# EAGLE design BusPirate-v3.5b-SSOP (EAGLE 5.07)
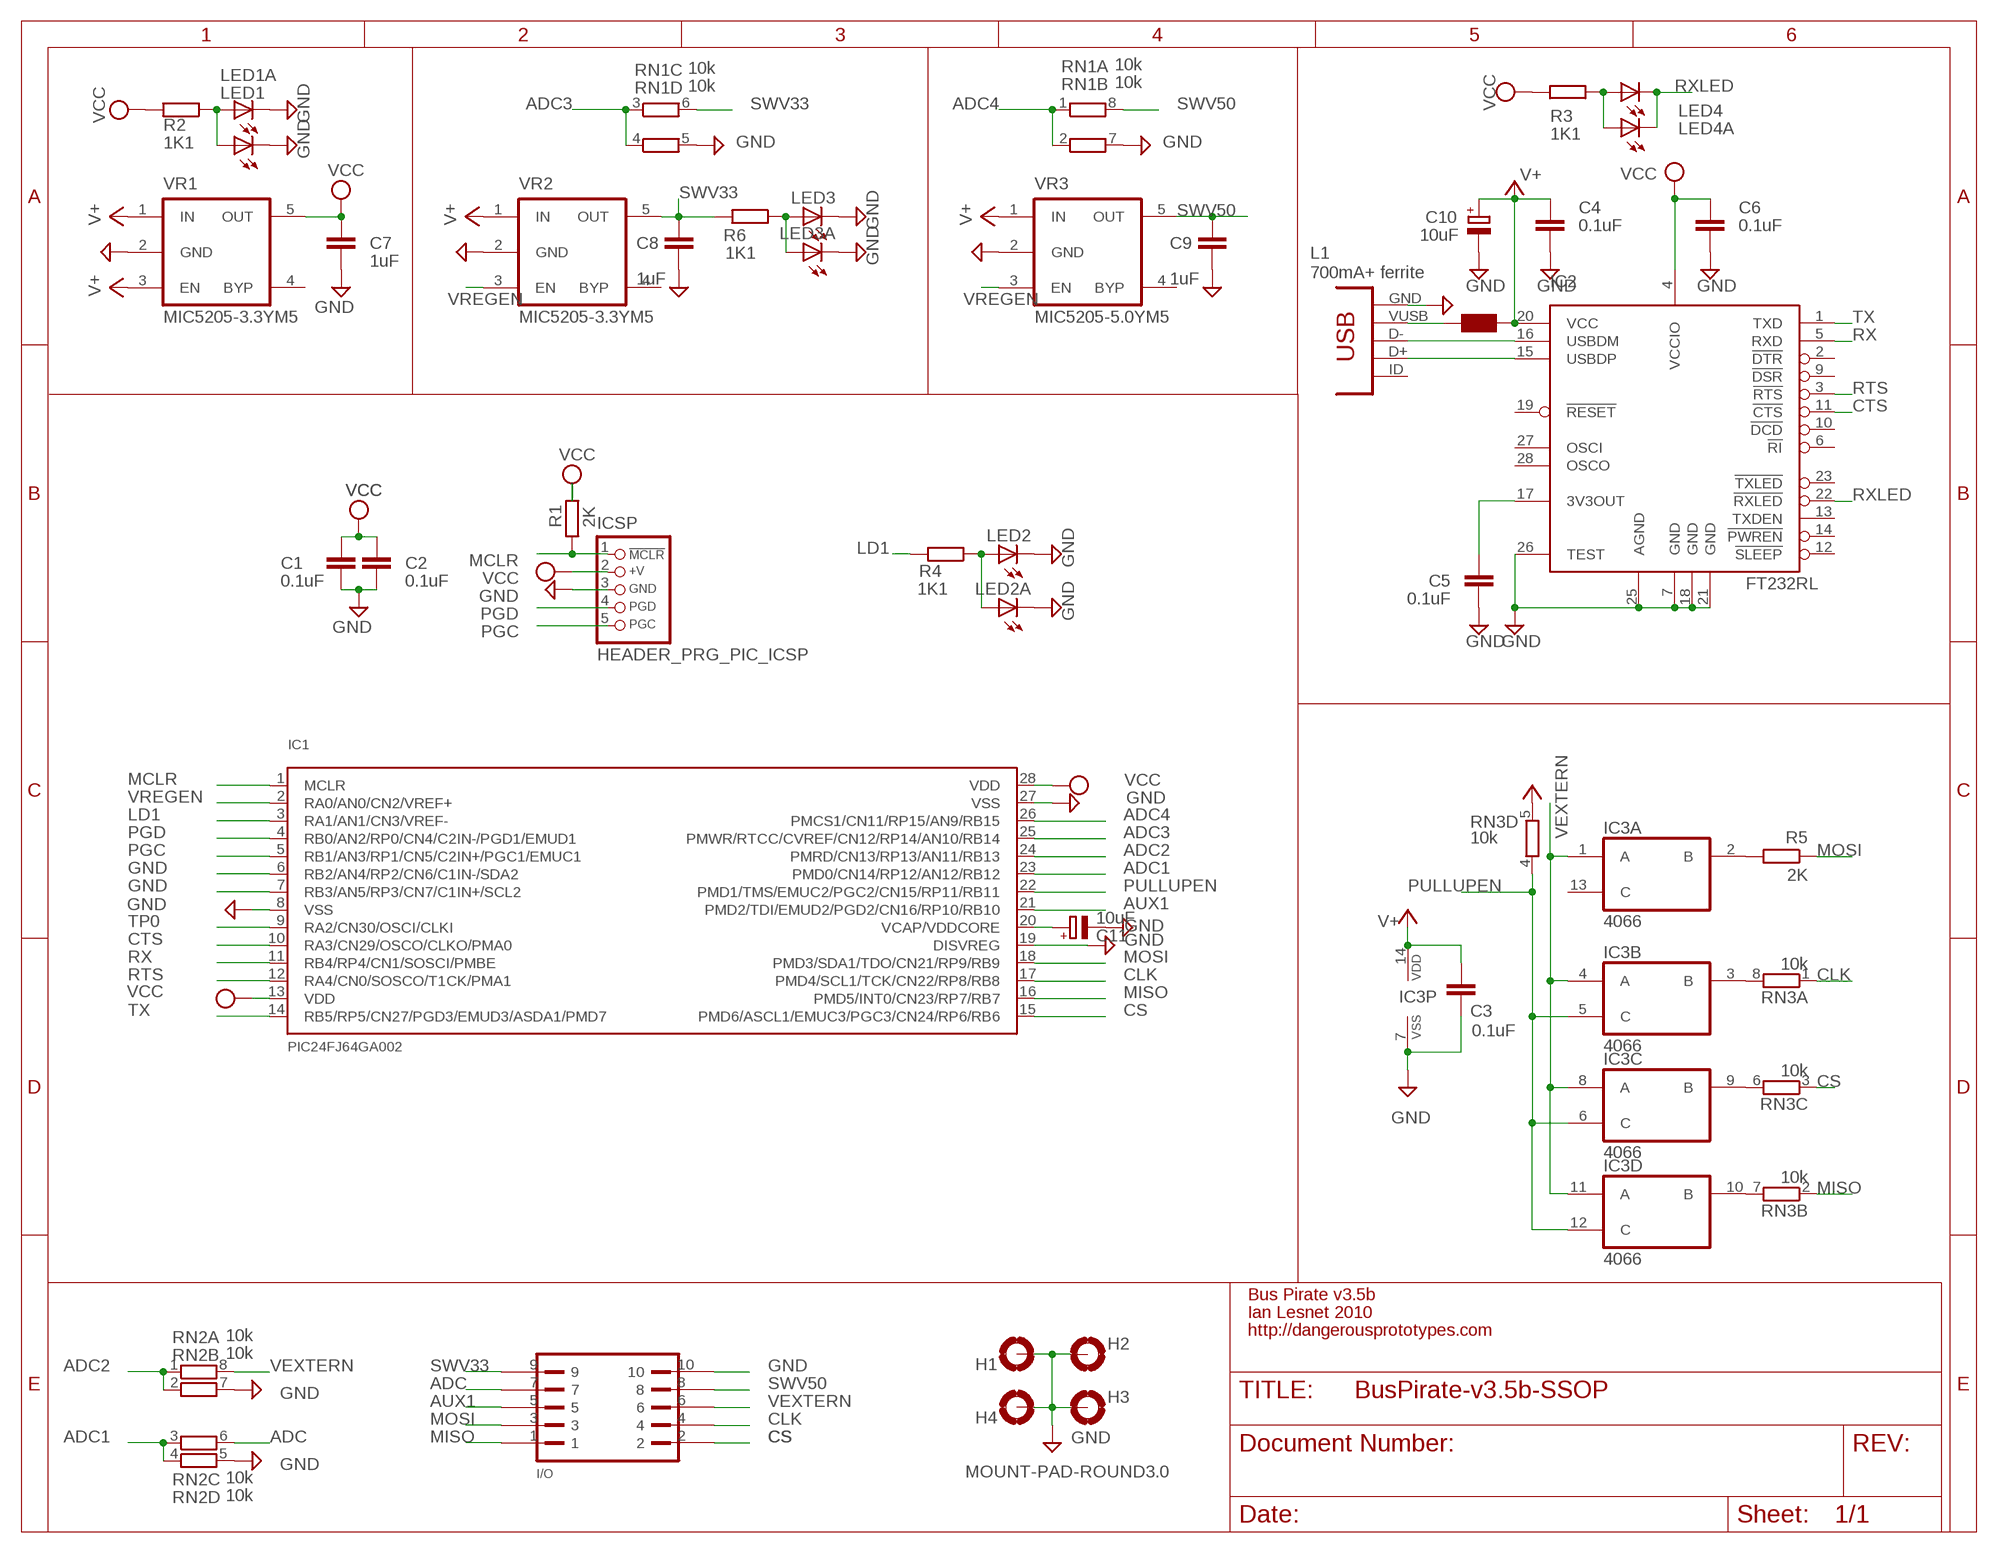
[diagram p0: schematic, sheet 1]

## Parts
C1  0.1uF  CAPC603  [C603]
C2  0.1uF  CAPC603  [C603]
C3  0.1uF  CAPC603  [C603]
C4  0.1uF  CAPC603  [C603]
C5  0.1uF  CAPC603  [C603]
C6  0.1uF  CAPC603  [C603]
C7  1uF  CAPC603  [C603]
C8  1uF  CAPC603  [C603]
C9  1uF  CAPC603  [C603]
C10  10uF  CPOL-EUSMCA  [SMC_A]
C11  10uF  CPOL-EUSMCA  [SMC_A]
H1  MOUNT-PAD-ROUND3.0  [3,0-PAD]
H2  MOUNT-PAD-ROUND3.0  [3,0-PAD]
H3  MOUNT-PAD-ROUND3.0  [3,0-PAD]
H4  MOUNT-PAD-ROUND3.0  [3,0-PAD]
I/O  HEADER2X5-SHRD-PTH-B  [PINSHRD_PTH_2X05B]
IC1  PIC24FJ64GA002  [SSOP28]
IC2  FT232RL  [SSOP28]
IC3  4066  [TSSOP14]
ICSP  HEADER_PRG_PIC_ICSP  HEADER_PRG_PIC_ICSPB  [HEADER_PRG_1X05_ICSP_B]
J1  CONN_USB  [CONN_USB_MINI-B]
L1  700mA+ ferrite  WE-KIL_0805  [WE-KI_0805_B]
LED1  LEDCHIP-LED0805  [CHIP-LED0805]
LED1A  LEDCHIP-LED0805  [CHIP-LED0805]
LED2  LEDCHIP-LED0805  [CHIP-LED0805]
LED2A  LEDCHIP-LED0805  [CHIP-LED0805]
LED3  LEDCHIP-LED0805  [CHIP-LED0805]
LED3A  LEDCHIP-LED0805  [CHIP-LED0805]
LED4  LEDCHIP-LED0805  [CHIP-LED0805]
LED4A  LEDCHIP-LED0805  [CHIP-LED0805]
R1  2K  RESISTORR603  [R603]
R2  1K1  RESISTORR603  [R603]
R3  1K1  RESISTORR603  [R603]
R4  1K1  RESISTORR603  [R603]
R5  2K  RESISTORR603  [R603]
R6  1K1  RESISTORR603  [R603]
RN1  10k  RNETWORK  [RN8P-4R-CRA06S]
RN2  10k  RNETWORK  [RN8P-4R-CRA06S]
RN3  10k  RNETWORK  [RN8P-4R-CRA06S]
VR1  MIC5205-3.3YM5  MIC5205  [SOT-23-5]
VR2  MIC5205-3.3YM5  MIC5205  [SOT-23-5]
VR3  MIC5205-5.0YM5  MIC5205  [SOT-23-5]

## Nets
$N26: J1.VUSB L1.2
ADC: I/O.7 RN2.6
ADC1: IC1.23(PMD0/CN14/RP12/AN12/RB12) RN2.3 RN2.4
ADC2: IC1.24(PMRD/CN13/RP13/AN11/RB13) RN2.1 RN2.2
ADC3: IC1.25(PMWR/RTCC/CVREF/CN12/RP14/AN10/RB14) RN1.3 RN1.4
ADC4: IC1.26(PMCS1/CN11/RP15/AN9/RB15) RN1.1 RN1.2
AUX1: I/O.5 IC1.21(PMD2/TDI/EMUD2/PGD2/CN16/RP10/RB10)
CLK: I/O.4 IC1.17(PMD4/SCL1/TCK/CN22/RP8/RB8) RN3.1
CS: I/O.2 IC1.15(PMD6/ASCL1/EMUC3/PGC3/CN24/RP6/RB6) RN3.3
CTS: IC1.10(RA3/CN29/OSCO/CLKO/PMA0) IC2.11(!CTS)
GND: C1.2 C2.2 C3.2 C4.2 C5.2 C6.2 C7.2 C8.2 C9.2 C10.- C11.- H1.B3,0(MOUNT) H2.B3,0(MOUNT) H3.B3,0(MOUNT) H4.B3,0(MOUNT) I/O.10 IC1.6(RB2/AN4/RP2/CN6/C1IN-/SDA2) IC1.7(RB3/AN5/RP3/CN7/C1IN+/SCL2) IC1.8(VSS) IC1.19(DISVREG) IC1.27(VSS) IC2.7(GND) IC2.18(GND) IC2.21(GND) IC2.25(AGND) IC2.26(TEST) IC3.7(P:VSS) ICSP.3(GND) J1.GND LED1.C LED1A.C LED2.C LED2A.C LED3.C LED3A.C RN1.5 RN1.7 RN2.5 RN2.7 VR1.2(GND) VR2.2(GND) VR3.2(GND)
LD1: IC1.3(RA1/AN1/CN3/VREF-) R4.2
MCLR: IC1.1(MCLR) ICSP.1(/MCLR) R1.1
MISO: I/O.1 IC1.16(PMD5/INT0/CN23/RP7/RB7) RN3.2
MOSI: I/O.3 IC1.18(PMD3/SDA1/TDO/CN21/RP9/RB9) R5.1
N$1: IC3.2(A:B) R5.2
N$2: IC3.9(C:B) RN3.6
N$3: C11.+ IC1.20(VCAP/VDDCORE)
N$4: IC3.10(D:B) RN3.7
N$5: IC3.3(B:B) RN3.8
N$6: LED2.A LED2A.A R4.1
N$7: LED1.A LED1A.A R2.1
N$9: C5.1 IC2.17(3V3OUT)
N$13: LED4.A LED4A.A R3.1
N$15: IC2.15(USBDP) J1.D+
N$16: IC2.16(USBDM) J1.D-
N$18: LED3.A LED3A.A R6.1
PGC: IC1.5(RB1/AN3/RP1/CN5/C2IN+/PGC1/EMUC1) ICSP.5(PGC)
PGD: IC1.4(RB0/AN2/RP0/CN4/C2IN-/PGD1/EMUD1) ICSP.4(PGD)
PULLUPEN: IC1.22(PMD1/TMS/EMUC2/PGC2/CN15/RP11/RB11) IC3.5(B:C) IC3.6(C:C) IC3.12(D:C) RN3.4
RTS: IC1.12(RA4/CN0/SOSCO/T1CK/PMA1) IC2.3(!RTS)
RX: IC1.11(RB4/RP4/CN1/SOSCI/PMBE) IC2.5(RXD)
RXLED: IC2.22(!RXLED) LED4.C LED4A.C
SWV33: C8.1 I/O.9 R6.2 RN1.6 VR2.5(OUT)
SWV50: C9.1 I/O.8 RN1.8 VR3.5(OUT)
TP0: IC1.9(RA2/CN30/OSCI/CLKI)
TX: IC1.14(RB5/RP5/CN27/PGD3/EMUD3/ASDA1/PMD7) IC2.1(TXD)
V+: C3.1 C4.1 C10.+ IC2.20(VCC) IC3.14(P:VDD) L1.1 RN3.5 VR1.1(IN) VR1.3(EN) VR2.1(IN) VR3.1(IN)
VCC: C1.1 C2.1 C6.1 C7.1 IC1.13(VDD) IC1.28(VDD) IC2.4(VCCIO) ICSP.2(+V) R1.2 R2.2 R3.2 VR1.5(OUT)
VEXTERN: I/O.6 IC3.1(A:A) IC3.4(B:A) IC3.8(C:A) IC3.11(D:A) RN2.8
VREGEN: IC1.2(RA0/AN0/CN2/VREF+) VR2.3(EN) VR3.3(EN)
Unconnected: IC2.2(!DTR) IC2.6(!RI) IC2.9(!DSR) IC2.10(!DCD) IC2.12(!SLEEP) IC2.13(TXDEN) IC2.14(!PWREN) IC2.19(!RESET) IC2.23(!TXLED) IC2.27(OSCI) IC2.28(OSCO) IC3.13(A:C) J1.BODY@1(BODY) J1.BODY@2(BODY) J1.BODY@3(BODY) J1.BODY@4(BODY) J1.ID(USBID) VR1.4(BYP) VR2.4(BYP) VR3.4(BYP)

## Notes on the sheet
- Bus Pirate v3.5b
- Ian Lesnet 2010
- http://dangerousprototypes.com

## Library data of the parts
C1-C9 = dp_devices:CAP
C10 C11 = rcl:CPOL-EU: POLARIZED CAPACITOR, European symbol
H1-H4 = holes:MOUNT-PAD-ROUND: MOUNTING PAD, round
I/O = dp_devices:HEADER2X5-SHRD-PTH: Shrouded pin header, 2.54mm pitch
IC1 = dp_devices:PIC24FJ64GA002: 16-bit General Purpose Flash Microcontroller
IC2 = dp_devices:FT232RL: USB to serial UART interface
IC3 = 40xx:4066: Quad bilateral ANALOG SWITCH
ICSP = dp_devices:HEADER_PRG_PIC_ICSP: 5-pin PIC In Circuit Serial Programming header
J1 = dp_devices:CONN_USB: USB connector
L1 = wuerth-elektronik:WE-KIL: SMD Wire Wound Ceramic Inductor WE-KIL - Low profile - High Q values -- Bluetooth -- Wireless LAN -- RF oscillation circuit -- IF impedance matching
LED1 LED1A LED2 LED2A LED3 LED3A LED4 LED4A = led:LED: LED OSRAM: - CHIPLED LG R971, LG N971, LY N971, LG Q971, LY Q971, LO R971, LY R971 LH N974, LH R974 LS Q976, LO Q976, LY Q976 LO Q996 - Hyper CHIPLED LW Q18S LB Q993, LB Q99A, LB R99A - SideLED LS A670, LO A670, LY A670, LG A670, LP A670 LB A673, LV A673, LT A673, LW A673 LH A674 LY A675 LS A676, LA A676, LO A676, LY A676, LW A676 LS A679, LY A679, LG A679 - Hyper Micro SIDELED® LS Y876, LA Y876, LO Y876, LY Y876 LT Y87S - SmartLED LW L88C, LW L88S LB L89C, LB L89S, LG L890 LS L89K, LO L89K, LY L89K LS L896, LA L896, LO L896, LY L896 - TOPLED LS T670, LO T670, LY T670, LG T670, LP T670 LSG T670, LSP T670, LSY T670, LOP T670, LYG T670 LG T671, LOG T671, LSG T671 LB T673, LV T673, LT T673, LW T673 LH T674 LS T676, LA T676, LO T676, LY T676, LB T676, LH T676, LSB T676, LW T676 LB T67C, LV T67C, LT T67C, LS T67K, LO T67K, LY T67K, LW E67C LS E67B, LA E67B, LO E67B, LY E67B, LB E67C, LV E67C, LT E67C LW T67C LS T679, LY T679, LG T679 LS T770, LO T770, LY T770, LG T770, LP T770 LB T773, LV T773, LT T773, LW T773 LH T774 LS E675, LA E675, LY E675, LS T675 LS T776, LA T776, LO T776, LY T776, LB T776 LHGB T686 LT T68C, LB T68C - Hyper Mini TOPLED® LB M676 - Mini TOPLED Santana® LG M470 LS M47K, LO M47K, LY M47K Source: http://www.osram.convergy.de LUXEON: - LUMILED® LXK2-PW12-R00, LXK2-PW12-S00, LXK2-PW14-U00, LXK2-PW14-V00 LXK2-PM12-R00, LXK2-PM12-S00, LXK2-PM14-U00 LXK2-PE12-Q00, LXK2-PE12-R00, LXK2-PE12-S00, LXK2-PE14-T00, LXK2-PE14-U00 LXK2-PB12-K00, LXK2-PB12-L00, LXK2-PB12-M00, LXK2-PB14-N00, LXK2-PB14-P00, LXK2-PB14-Q00 LXK2-PR12-L00, LXK2-PR12-M00, LXK2-PR14-Q00, LXK2-PR14-R00 LXK2-PD12-Q00, LXK2-PD12-R00, LXK2-PD12-S00 LXK2-PH12-R00, LXK2-PH12-S00 LXK2-PL12-P00, LXK2-PL12-Q00, LXK2-PL12-R00 Source: www.luxeon.com KINGBRIGHT: KA-3528ASYC Source: www.kingbright.com
R1-R6 = dp_devices:RESISTOR
RN1-RN3 = dp_devices:RNETWORK: 4 Resistor Array 0603
VR1-VR3 = dp_devices:MIC5205: 150ma Low-Noise LDO Regulator

## Board
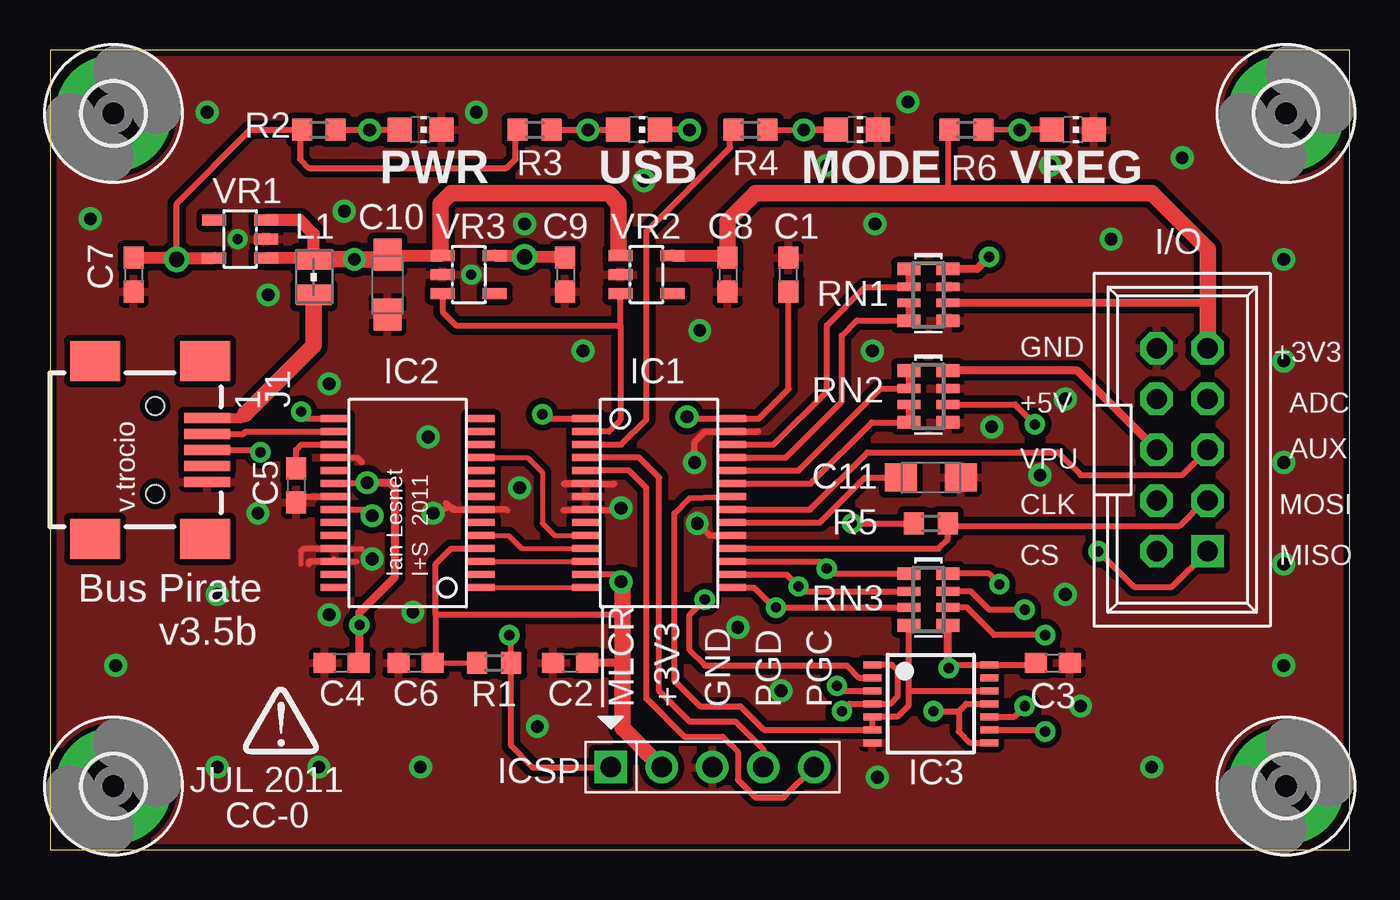
[diagram p1: board, top side]
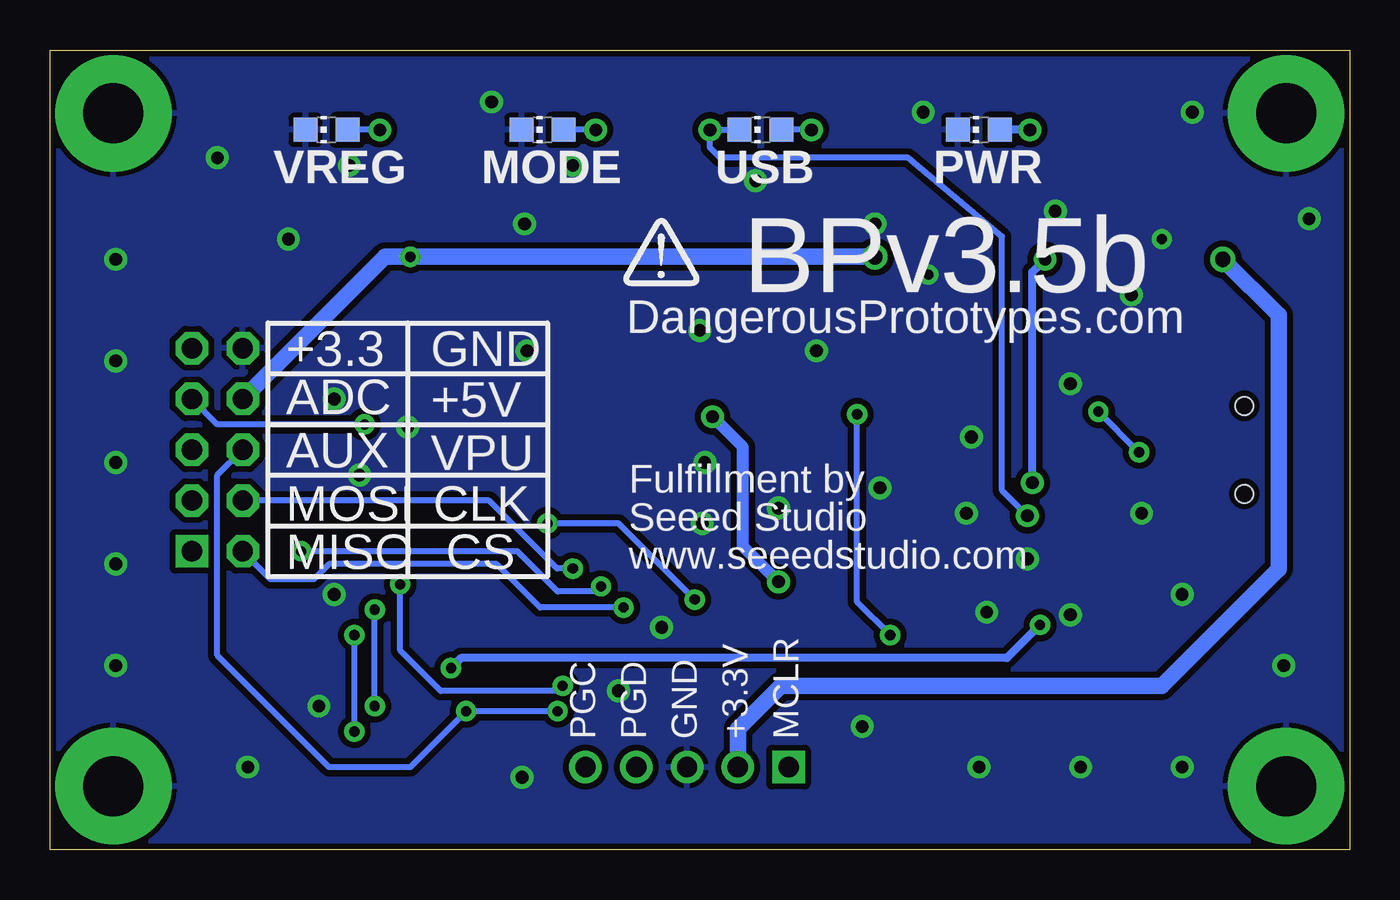
[diagram p2: board, bottom side, seen from below]

Size 65 x 40 mm. Coordinates in mm from the lower left corner, seen from the top.
Outline: 0,40 0,0 65,0 65,40 0,40
Copper layers (1*16): Top 0.035mm / dielectric 1.5mm / Bottom 0.035mm
Design rules "SparkFun": minimum track width 8mil, minimum drill 20mil, track to track 8mil, track to pad 8mil, pad to pad 8mil, via to via 8mil, smd to smd 8mil, copper to edge 10mil, drill to drill 8mil, minimum pad ring 12mil, minimum via ring 10mil, stop-mask expansion 4mil, vias tented up to drill 25mil, thermal gap 10mil

### Footprints (pad centres in the part's own frame; a part is rotated, then mirrored left to right if it is on the bottom)
C603 = smd 1.1 x 1: 1 -0.85,0; 2 0.85,0
SMC_A = smd 1.6 x 1.4: + -1.5,0; - 1.5,0
3,0-PAD = drill 3 pad 5.842 round: B3,0 0,0
PINSHRD_PTH_2X05B = drill 1.016 square: 1 -5.08,-1.27 | drill 1.016 octagon: 2 -5.08,1.27; 3 -2.54,-1.27; 4 -2.54,1.27; 5 0,-1.27; 6 0,1.27; 7 2.54,-1.27; 8 2.54,1.27; 9 5.08,-1.27; 10 5.08,1.27
SSOP28 = smd 0.348 x 1.397: 1 -4.225,-3.656; 2 -3.575,-3.656; 3 -2.925,-3.656; 4 -2.275,-3.656; 5 -1.625,-3.656; 6 -0.975,-3.656; 7 -0.325,-3.656; 8 0.325,-3.656; 9 0.975,-3.656; 10 1.625,-3.656; 11 2.275,-3.656; 12 2.925,-3.656; 13 3.575,-3.656; 14 4.225,-3.656; 15 4.225,3.656; 16 3.575,3.656; 17 2.925,3.656; 18 2.275,3.656; 19 1.625,3.656; 20 0.975,3.656; 21 0.325,3.656; 22 -0.325,3.656; 23 -0.975,3.656; 24 -1.625,3.656; 25 -2.275,3.656; 26 -2.925,3.656; 27 -3.575,3.656; 28 -4.225,3.656
TSSOP14 = smd 0.35 x 0.9: 1 -1.95,-2.925; 2 -1.3,-2.925; 3 -0.65,-2.925; 4 0,-2.925; 5 0.65,-2.925; 6 1.3,-2.925; 7 1.95,-2.925; 8 1.95,2.925; 9 1.3,2.925; 10 0.65,2.925; 11 0,2.925; 12 -0.65,2.925; 13 -1.3,2.925; 14 -1.95,2.925
HEADER_PRG_1X05_ICSP_B = drill 1.016 square: 1 -5.08,0 | drill 1.016 round: 2 -2.54,0; 3 0,0; 4 2.54,0; 5 5.08,0
CONN_USB_MINI-B@1 = smd 2 x 2.5: BODY@1 -4.45,2.5; BODY@2 4.45,2.5; BODY@3 4.45,-3; BODY@4 -4.45,-3 | smd 0.5 x 2.3: D+ 0,2.6; D- -0.8,2.6; GND 1.6,2.6; ID 0.8,2.6; VUSB -1.6,2.6 | hole 0.9: -2.2,0; 2.2,0
WE-KI_0805_B = smd 1.02 x 1.78: 1 -0.89,0; 2 0.89,0
CHIP-LED0805 = smd 1.2 x 1.2: A 0,-1.05; C 0,1.05
R603 = smd 1 x 1.1: 1 -0.85,0; 2 0.85,0
RN8P-4R-CRA06S = smd 0.63 x 1.15: 1 -1.295,-0.975; 4 1.295,-0.975; 5 1.295,0.975; 8 -1.295,0.975 | smd 0.44 x 1.15: 2 -0.4,-0.975; 3 0.4,-0.975; 6 0.4,0.975; 7 -0.4,0.975
SOT-23-5 = smd 0.55 x 1.2: 1 -0.95,-1.3; 2 0,-1.3; 3 0.95,-1.3; 4 0.95,1.3; 5 -0.95,1.3

### Placement (x,y rotation side)
C1  36.95,28.76 90 top
C2  26.02,9.33 180 top
C3  50.15,9.33 0 top
C4  14.59,9.33 180 top
C5  12.31,18.22 270 top
C6  18.28,9.33 180 top
C7  4.18,28.76 270 top
C8  33.9,28.76 270 top
C9  25.77,28.76 270 top
C10  16.88,28.25 270 top
C11  44.06,18.6 0 top
H1  3.17,3.17 0 top
H2  3.17,36.83 0 top
H3  61.83,36.83 0 top
H4  61.83,3.17 0 top
I/O  56.63,20 90 top
IC1  30.47,17.33 270 top
IC2  17.89,17.33 90 top
IC3  44.06,7.3 270 top
ICSP  33.13,4.12 0 top
J1  CONN_USB  [CONN_USB_MINI-B@1]  5.26,20 270 top
L1  13.2,28.64 270 top
LED1  18.53,36 270 top
LED1A  18.53,36 90 bottom
LED2  40.37,36 270 top
LED2A  40.37,36 90 bottom
LED3  51.17,36 270 top
LED3A  51.17,36 90 bottom
LED4  29.45,36 270 top
LED4A  29.45,36 90 bottom
R1  22.21,9.33 180 top
R2  13.45,36 180 top
R3  24.25,36 180 top
R4  35.04,36 180 top
R5  44.06,16.32 180 top
R6  45.84,36 180 top
RN1  43.93,27.75 270 top
RN2  43.93,22.67 270 top
RN3  43.93,12.51 270 top
U$1  [DP-LOGO]  9.64,4.76 0 top
U$2  [DP-LOGO-BOTTOM]  32.51,28.19 0 top
VR1  9.51,30.54 90 top
VR2  29.83,28.76 270 top
VR3  20.94,28.76 270 top

### Tracks (layer width: path | path; a pad name or v marks a point on that pad's centre or on a via)
$N26
  Top 0.508: J1.VUSB 9.59,21.6 9.77,21.78
  Top 0.813: L1.2 13.2,25.21 9.77,21.78
ADC  (via drill 0.51)
  Top 0.305: RN2.6 48.27,22.27 v49.26,21.27
  Bottom 0.305: v49.26,21.27 56.63,21.27 I/O.7
ADC1
  Top 0.305: RN2.3 RN2.4 41.11,21.37 38.05,18.31 IC1.23
ADC2
  Top 0.305: RN2.1 RN2.2 41.54,23.07 37.43,18.96 IC1.24
ADC3
  Top 0.305: RN1.3 RN1.4 40.4,26.45 40.37,26.48 39.61,25.71 39.61,22.41 36.81,19.61 IC1.25
ADC4
  Top 0.305: RN1.1 RN1.2 40.77,28.15 38.85,26.22 38.85,22.92 36.19,20.26 IC1.26
AUX1
  Top 0.305: IC1.21 38.02,17.01 40.88,19.87 50.41,19.87 51.55,18.73 56.63,18.73 I/O.5
CLK  (via drill 0.51)
  Top 0.305: IC1.17 38.5,14.41 v38.85,14.06 39.1,13.8 RN3.1
  Bottom 0.305: v38.85,14.06 39.64,14.06 43.04,17.46 I/O.4
CS  (via drill 0.51)
  Top 0.305: IC1.15 35.2,13.11 36.2,12.11 v36.31,12.11 RN3.3
  Bottom 0.305: v36.31,12.11 40.48,12.11 42.66,14.29 51.04,14.29 51.8,13.52 53.96,13.52 I/O.2
CTS
  Top 0.254: IC2.11 23.88,19.61 24.63,18.86 24.63,16.32 25.23,15.71 IC1.10
GND  (via drill 0.51, 0.64)
  Top 0.254: IC2.18 15.37,19.61 | 12.56,14.29 12.56,14.92 | 14.09,15.05 15.61,15.05 | 14.21,14.41 14.21,14.54 | 14.21,14.41 15.36,14.41 | IC2.26 14.22,14.41 14.21,14.41
  Top 0.305: 20.12,17.01 20.2,17.08 20.05,17.08 | 20.05,17.08 19.8,17.08 | 20.12,17.01 IC2.7 | 20.05,17.08 19.8,17.33 | 20.12,17.01 20.05,17.08 | 15.37,19.61 15.61,19.36 | IC2.21 12.43,17.66 C5.2 | IC2.25 12.7,15.06 12.56,14.92 | IC2.26 12.94,14.41 12.94,14.29 | v32.25,19.36 32.25,20.38 32.77,20.91 IC1.27 | IC1.19 32.98,15.71 v32.37,16.32 | 28.23,18.3 25.69,18.3 25.7,18.31 IC1.6 | 25.67,16.98 28.46,16.98 | IC1.27 35.42,20.91 | IC1.27 34,20.91 | 21.32,17 22.85,17 22.87,16.98
  other vias: 23.74,31.3 21.07,28.76 9.39,30.54 8.37,4.12 13.45,4.12 18.53,4.12 24.37,6.16 3.29,9.21 55.11,4.12 61.71,9.21 61.71,14.29 61.71,19.36 61.71,24.45 61.71,29.52 56.63,34.6 53.07,30.54 41.26,31.3 38.85,34.22 50.03,34.22 29.71,33.46 14.72,31.94 18.91,20.64 19.16,16.82 18.15,11.87 13.96,11.74 8.37,12.76 10.4,16.82 10.91,27.75 13.96,23.3 34.41,11.11 16.12,14.54 50.79,12.76 51.55,7.17 41.39,3.62 49.52,18.73 50.79,22.54 47.1,21.14 23.48,18.09 28.56,17.08 36.56,7.93 41.14,24.95 32.5,25.97 26.66,24.95 2.02,31.56 7.86,36.89 21.32,36.89 42.91,37.4
  pour Top (isolate 0.305): 0,40 65,40 65,0 0,0
  pour Bottom (isolate 0.305): 0,40 65,40 65,0 0,0
LD1
  Top 0.305: 34.28,35.88 R4.2 34.02,35.84 34.02,35.11 29.83,30.92 29.83,21.52 28.57,20.26 IC1.3
  Top 0.406: R4.2 33.9,35.68
MCLR  (via drill 0.51)
  Top 0.305: ICSP.1 24.12,4.12 23.06,5.18 R1.1 23.06,10.64 v22.98,10.73 | IC1.1 24.85,21.56 v24.63,21.78
  Bottom 0.305: v24.63,21.78 24.63,12.38 v22.98,10.73
MISO  (via drill 0.51)
  Top 0.305: I/O.1 56.12,13.14 54.22,13.14 v52.44,14.92 | IC1.16 36.84,13.76 v37.43,13.16 | v37.43,13.16 37.33,13.27 | v37.43,13.16 37.69,12.91 RN3.2
  Bottom 0.305: v52.44,14.92 41.62,14.92 39.61,12.91 37.69,12.91 v37.43,13.16
MOSI
  Top 0.305: I/O.3 57.77,17.46 56.5,16.19 45.03,16.19 R5.1 44.91,15.52 44.45,15.06 IC1.18
N$1  (via drill 0.51)
  Top 0.305: v40.12,16.32 R5.2 | IC3.2 40.47,8.6 39.87,9.21 32.75,9.21 31.99,9.97 31.99,11.74 v32.75,12.51
  Bottom 0.305: v40.12,16.32 36.56,16.32 v32.75,12.51
N$2  (via drill 0.51)
  Top 0.305: IC3.9 49.67,6 v49.77,5.9 | RN3.6 45.85,12.11 47.23,10.73 v49.77,10.73
  Bottom 0.305: v49.77,5.9 v49.77,10.73
N$3
  Top 0.305: IC1.20 38.51,16.36 40.76,18.6 C11.+
N$4  (via drill 0.51)
  Top 0.305: IC3.10 48.23,6.65 v48.76,7.17 | RN3.7 46.07,12.91 46.98,12 v48.76,12
  Bottom 0.305: v48.76,7.17 v48.76,12
N$5  (via drill 0.51)
  Top 0.305: RN3.8 46.95,13.8 v47.49,13.27 | IC3.3 39.6,7.95 v39.36,8.19
  Bottom 0.305: v47.49,13.27 47.49,9.97 45.45,7.93 39.61,7.93 v39.36,8.19
N$6  (via drill 0.64)
  Top 0.305: 36.15,35.98 LED2A.A v37.71,36
  Top 0.406: R4.1 36.15,35.98
  Bottom 0.305: v37.71,36 LED2A.A
N$7  (via drill 0.64)
  Top 0.305: LED1A.A v15.99,36 R2.1
  Top 0.406: R2.1 14.21,36
  Bottom 0.406: v15.99,36 LED1A.A
N$9
  Top 0.305: IC2.17 12.56,20.26 12.31,20 C5.1
N$13  (via drill 0.64)
  Top 0.305: R3.1 v26.91,36 LED4A.A
  Bottom 0.305: v26.91,36 LED4A.A
N$15  (via drill 0.51)
  Top 0.305: J1.D+ 10.4,20 v10.53,19.87 | IC2.15 12.91,21.56 v12.56,21.91
  Bottom 0.305: v10.53,19.87 v12.56,21.91
N$16
  Top 0.254: IC2.16 14.26,20.89
  Top 0.305: IC2.16 9.79,20.91 9.68,20.8 J1.D-
N$18  (via drill 0.64)
  Top 0.305: R6.1 50.09,36.03 | LED3A.A v48.5,36
  Top 0.406: 50.09,36.03 LED3A.A
  Bottom 0.305: v48.5,36 LED3A.A
PGC
  Top 0.305: ICSP.5 36.69,2.6 35.29,2.6 34.41,3.49 34.41,4.89 33.64,5.65 31.74,5.65 29.83,7.55 29.83,18.09 28.97,18.96 IC1.5
PGD
  Top 0.305: ICSP.4 35.67,5.01 34.28,6.41 31.99,6.41 30.47,7.93 30.47,18.6 29.46,19.61 IC1.4
PULLUPEN
  Top 0.305: 42.95,7.93 42.95,7.21 42.41,6.67 41.15,6.67 IC3.5 IC3.6 35.7,6 34.53,7.17 32.5,7.17 31.23,8.44 31.23,16.82 31.99,17.59 IC1.22 | 42.95,7.93 RN3.4 | IC3.12 42.97,7.95 42.95,7.93
RTS
  Top 0.254: IC2.3 IC1.12
RX
  Top 0.254: IC2.5 22.95,15.71 23.6,15.06 IC1.11
RXLED  (via drill 0.64)
  Top 0.305: v31.99,36 LED4A.C | IC2.22 15.79,17.01 v16.12,16.7
  Top 0.406: LED4A.C 30.09,36
  Bottom 0.305: LED4A.C v31.99,36 31.99,35.11 31.48,34.6 22.09,34.6 17.39,30.67 17.39,17.97 v16.12,16.7
SWV33
  Top 0.305: R6.2 44.95,35.88 44.95,32.89 44.88,32.89 44.95,32.83
  Top 0.406: R6.2 45.01,36 | RN1.6 57.75,27.35 57.9,27.49
  Top 0.61: VR2.5 33.9,29.71 C8.1
  Top 0.813: C8.1 33.9,31.43 35.29,32.83 44.95,32.83 55.11,32.83 57.9,30.03 57.9,27.49 I/O.9
SWV50  (via drill 0.51, 0.76)
  Top 0.406: RN1.8 46.37,29.04 v46.98,29.65
  Top 0.61: VR3.5 23.68,29.71 | v23.74,29.65 25.73,29.65 C9.1
  Top 0.813: 23.68,29.71 v23.74,29.65
  Bottom 0.813: I/O.8 48.25,29.65 v46.98,29.65 v23.74,29.65
TX
  Top 0.254: IC2.1 IC1.14
V+  (via drill 0.51, 0.64)
  Top 0.305: IC2.20 15.82,18.31 v15.86,18.35 | C3.1 49.22,9.25 IC3.14 45.03,9.25 v44.95,9.08 | VR2.1 | 28.53,29.94 VR2.1
  Top 0.406: v15.48,11.24 15.48,10.03 C4.1 15.48,9.37 v15.48,11.24 | v15.48,11.24 15.48,11.87 17.26,13.65 17.26,18.09 17.01,18.35 v15.86,18.35 | RN3.5 44.91,9.88 v44.95,9.08
  Top 0.508: 28.44,30.03 28.53,29.94
  Top 0.61: L1.1 13.2,30.8 12.5,31.49 VR1.3 | L1.1 13.13,29.59 | VR1.1 13.2,29.59 L1.1 | C10.+ 16.92,29.71 VR3.1 19.55,29.81 19.55,30.03
  Top 0.813: L1.1 v15.23,29.53 v15.23,29.52 16.5,29.52 16.75,29.78 16.9,29.78 C10.+ | 19.55,30.03 19.55,32.32 20.05,32.83 27.93,32.83 28.44,32.32 28.44,30.03
  Bottom 0.406: v15.86,18.35 15.86,28.89 v15.23,29.52 | v15.48,11.24 17.13,9.59 44.44,9.59 v44.95,9.08
VCC  (via drill 0.64, 0.76)
  Top 0.254: C6.1 R1.2
  Top 0.305: 28.71,13.76 v28.56,13.4 28.2,13.76 IC1.13 | v6.34,29.52 6.34,32.32 10.02,36 R2.2 12.43,35.88 12.5,35.81 12.5,34.54 12.94,34.1 22.85,34.1 23.3,34.54 23.3,36.07 23.36,36.13 R3.2 | v31.86,21.65 31.96,21.56 IC1.28 35.45,21.56 36.95,23.05 C1.1 | 28.63,11.74 19.29,11.74 | 19.29,11.74 19.29,9.5 C6.1 | IC2.4 20.07,15.06 19.29,14.29 19.29,11.74
  Top 0.406: C2.1 28.5,9.33 28.63,9.21
  Top 0.508: v6.34,29.52 6.4,29.59
  Top 0.61: 28.63,13.33 v28.56,13.4 | VR1.5 6.34,29.59 v6.34,29.52 | 6.27,29.59 4.18,29.59 C7.1
  Top 0.813: v6.34,29.52 6.27,29.59 | 30.66,4.19 ICSP.2 28.63,6.09 28.63,9.21 28.63,11.74 28.63,13.33
  Bottom 0.61: v28.56,13.4 30.34,15.17 30.34,20.13 v31.86,21.65
  Bottom 0.813: v6.34,29.52 3.54,26.73 3.54,14.03 9.39,8.19 28.44,8.19 30.59,6.03 ICSP.2
VEXTERN  (via drill 0.51)
  Top 0.305: IC3.8 46.01,5.35 45.45,5.9 45.45,6.92 | IC3.11 45.84,7.3 45.45,6.92 | IC3.1 42.11,9.25 42.41,8.95 42.41,7.68 42.02,7.3 IC3.4 39.99,7.3 v39.61,6.92 | v44.18,6.92 45.45,6.92
  Top 0.406: RN2.8 51.4,23.96 I/O.6
  Bottom 0.305: v39.61,6.92 v44.18,6.92 46.98,4.12 51.04,4.12 56.63,9.71 56.63,18.73 I/O.6
VREGEN
  Top 0.305: 19.64,26.89 20.31,26.22 28.53,26.22 | 28.53,26.22 28.53,21.49 27.95,20.91 IC1.2 | VR2.3 | 28.53,26.22 VR2.3 | VR3.3 19.64,26.89 | 19.64,26.89

### Text on the board
tPlace: GND | +3V3 | +5V | ADC | AUX | VPU | CLK | MOSI | CS | MISO | !MLCR | +3V3 | GND | PGD | PGC
tNames: PWR | USB | MODE | VREG | v.trocio | 2011 | Ian Lesnet | I+S | Bus Pirate | v3.5b | JUL 2011 | CC-0
bNames: PWR | USB | MODE | VREG | BPv3.5b | DangerousPrototypes.com | GND | +3.3 | +5V | ADC | VPU | AUX | Fulfillment by | Seeed Studio | CLK | MOSI | www.seeedstudio.com | CS | MISO | MCLR | +3.3V | GND | PGD | PGC
Reference: GND | +3v | +5v | ADC | USB | Vpu | AUX | CLK | MOSI | CS | MISO | I/O header | MCLR | +3.3V | GND | DATA | CLOCK | Bus Pirate v3.5b | Ian Lesnet | CC-0 | JUL 2011 | Programming Header | http://dangerousprototypes.com